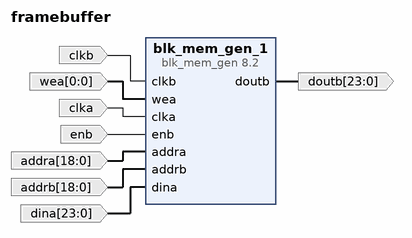
[diagram p0: block diagram of the top level]
# Vivado block design framebuffer, Vivado 2015.2
create_bd_design framebuffer

create_bd_port -dir I clkb
create_bd_port -dir I -from 0 -to 0 wea
create_bd_port -dir I clka
create_bd_port -dir I enb
create_bd_port -dir I -from 18 -to 0 addra
create_bd_port -dir I -from 18 -to 0 addrb
create_bd_port -dir I -from 23 -to 0 dina
create_bd_port -dir O -from 23 -to 0 doutb

create_bd_cell -type ip -vlnv xilinx.com:ip:blk_mem_gen:8.2 blk_mem_gen_1
set_property -dict [list \
  CONFIG.Memory_Type Simple_Dual_Port_RAM \
  CONFIG.Enable_32bit_Address false \
  CONFIG.Use_Byte_Write_Enable false \
  CONFIG.Write_Width_A 24 \
  CONFIG.Write_Depth_A 345600 \
  CONFIG.Operating_Mode_A NO_CHANGE \
  CONFIG.Enable_A Always_Enabled \
  CONFIG.Write_Width_B 24 \
  CONFIG.Read_Width_B 24 \
  CONFIG.Enable_B Use_ENB_Pin \
  CONFIG.Register_PortB_Output_of_Memory_Primitives true \
  CONFIG.Load_Init_File true \
  CONFIG.Coe_File ../../../../../../foo.coe \
  CONFIG.Fill_Remaining_Memory_Locations true \
  CONFIG.Remaining_Memory_Locations AB \
  CONFIG.Port_B_Clock 100 \
  CONFIG.Port_B_Enable_Rate 100 \
  CONFIG.use_bram_block Stand_Alone \
] [get_bd_cells blk_mem_gen_1]

# ---- connections ----

connect_bd_net [get_bd_ports clkb] [get_bd_pins blk_mem_gen_1/clkb]
connect_bd_net [get_bd_ports wea] [get_bd_pins blk_mem_gen_1/wea]
connect_bd_net [get_bd_ports clka] [get_bd_pins blk_mem_gen_1/clka]
connect_bd_net [get_bd_ports enb] [get_bd_pins blk_mem_gen_1/enb]
connect_bd_net [get_bd_ports addra] [get_bd_pins blk_mem_gen_1/addra]
connect_bd_net [get_bd_ports addrb] [get_bd_pins blk_mem_gen_1/addrb]
connect_bd_net [get_bd_ports dina] [get_bd_pins blk_mem_gen_1/dina]
connect_bd_net [get_bd_pins blk_mem_gen_1/doutb] [get_bd_ports doutb]

validate_bd_design
save_bd_design
